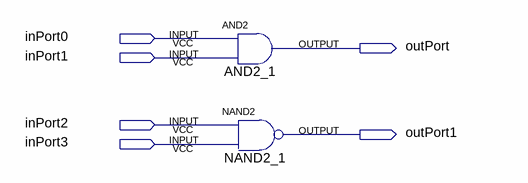
[diagram p0: schematic sheet]
// Quartus schematic GateDemo.bdf as structural Verilog: 2 symbols, 6 pins
module GateDemo (
  input  inPort0,
  input  inPort1,
  input  inPort2,
  input  inPort3,
  output outPort,
  output outPort1
);

  and AND2_1 (outPort, inPort0, inPort1);
  nand NAND2_1 (outPort1, inPort2, inPort3);
endmodule
